# EAGLE design p8x-cf-card (EAGLE 9.6.2)
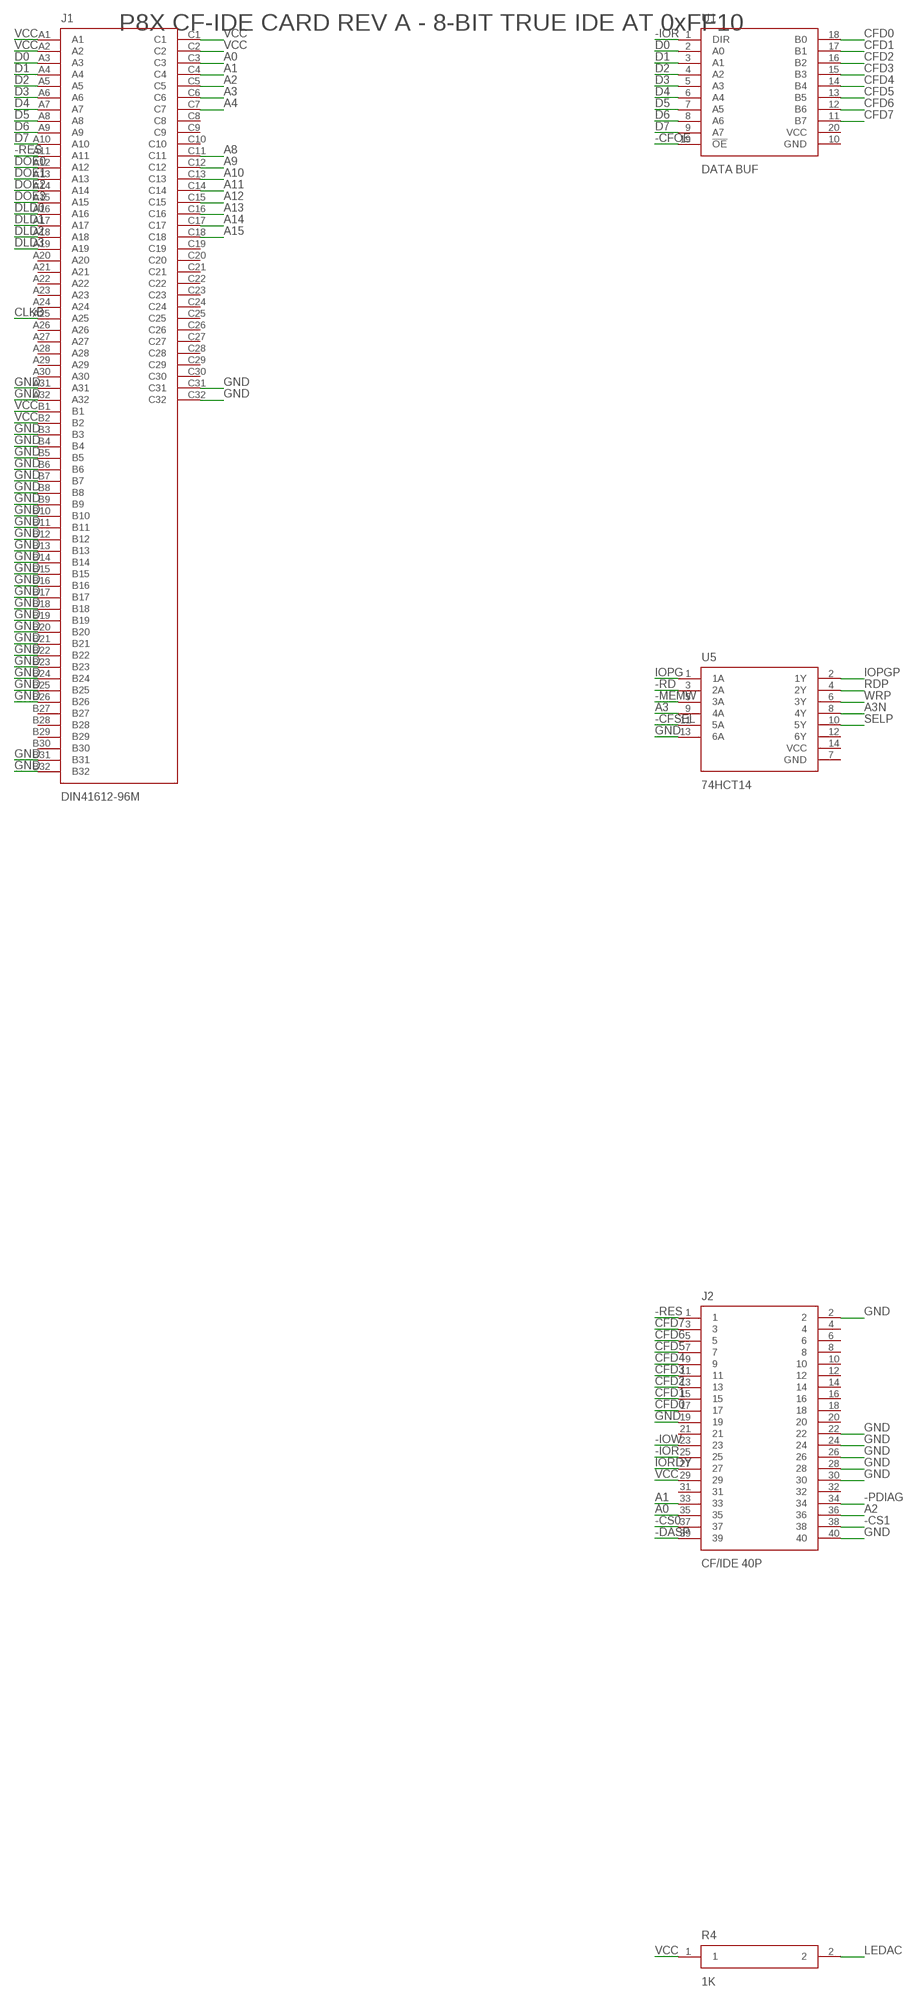
[diagram p0: schematic, sheet 1, part 1 of 2]
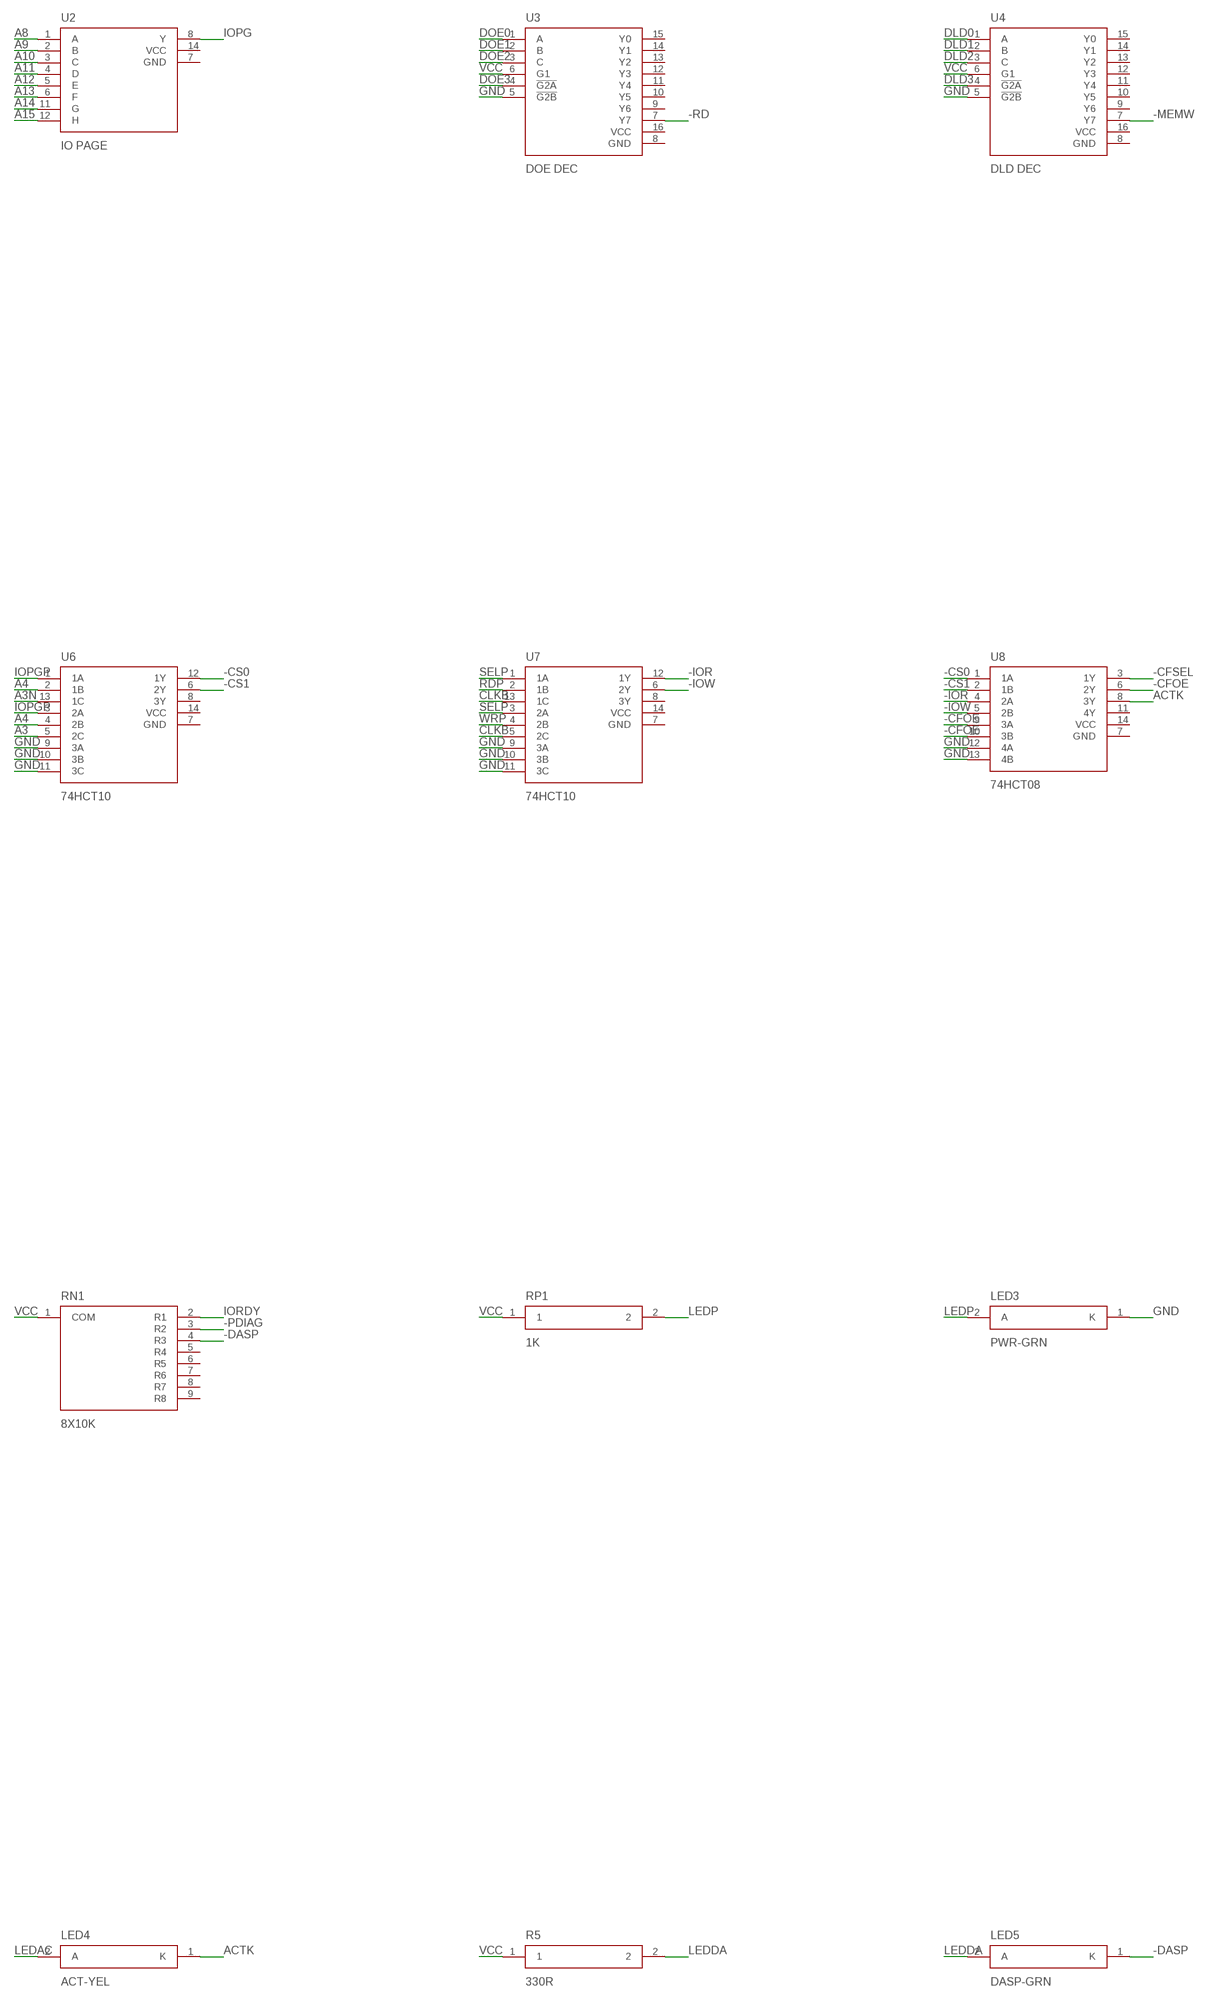
[diagram p1: schematic, sheet 1, part 2 of 2]

## Parts
J1  DIN41612-96M  DIN96  [DIN96]
J2  CF/IDE 40P  IDE40  [HDR40]
LED3  PWR-GRN  LED  [LED5]
LED4  ACT-YEL  LED  [LED5]
LED5  DASP-GRN  LED  [LED5]
R4  1K  RES  [R_AXIAL]
R5  330R  RES  [R_AXIAL]
RN1  8X10K  SIP9  [SIP9]
RP1  1K  RES  [R_AXIAL]
U1  DATA BUF  74245  [DIP20]
U2  IO PAGE  7430  [DIP14]
U3  DOE DEC  74138  [DIP16]
U4  DLD DEC  74138  [DIP16]
U5  74HCT14  HEX14  [DIP14]
U6  74HCT10  7410  [DIP14]
U7  74HCT10  7410  [DIP14]
U8  74HCT08  GATES14  [DIP14]

## Nets
-CFOE: U1.19(!OE) U8.6(2Y) U8.9(3A) U8.10(3B)
-CFSEL: U5.11(5A) U8.3(1Y)
-CS0: J2.37 U6.12(1Y) U8.1(1A)
-CS1: J2.38 U6.6(2Y) U8.2(1B)
-DASP: J2.39 LED5.1(K) RN1.4(R3)
-IOR: J2.25 U1.1(DIR) U7.12(1Y) U8.4(2A)
-IOW: J2.23 U7.6(2Y) U8.5(2B)
-MEMW: U4.7(Y7) U5.5(3A)
-PDIAG: J2.34 RN1.3(R2)
-RD: U3.7(Y7) U5.3(2A)
-RES: J1.A11 J2.1
A0: J1.C3 J2.35
A1: J1.C4 J2.33
A2: J1.C5 J2.36
A3: J1.C6 U5.9(4A) U6.5(2C)
A3N: U5.8(4Y) U6.13(1C)
A4: J1.C7 U6.2(1B) U6.4(2B)
A8: J1.C11 U2.1(A)
A9: J1.C12 U2.2(B)
A10: J1.C13 U2.3(C)
A11: J1.C14 U2.4(D)
A12: J1.C15 U2.5(E)
A13: J1.C16 U2.6(F)
A14: J1.C17 U2.11(G)
A15: J1.C18 U2.12(H)
ACTK: LED4.1(K) U8.8(3Y)
CFD0: J2.17 U1.18(B0)
CFD1: J2.15 U1.17(B1)
CFD2: J2.13 U1.16(B2)
CFD3: J2.11 U1.15(B3)
CFD4: J2.9 U1.14(B4)
CFD5: J2.7 U1.13(B5)
CFD6: J2.5 U1.12(B6)
CFD7: J2.3 U1.11(B7)
CLKB: J1.A25 U7.5(2C) U7.13(1C)
D0: J1.A3 U1.2(A0)
D1: J1.A4 U1.3(A1)
D2: J1.A5 U1.4(A2)
D3: J1.A6 U1.5(A3)
D4: J1.A7 U1.6(A4)
D5: J1.A8 U1.7(A5)
D6: J1.A9 U1.8(A6)
D7: J1.A10 U1.9(A7)
DLD0: J1.A16 U4.1(A)
DLD1: J1.A17 U4.2(B)
DLD2: J1.A18 U4.3(C)
DLD3: J1.A19 U4.4(!G2A)
DOE0: J1.A12 U3.1(A)
DOE1: J1.A13 U3.2(B)
DOE2: J1.A14 U3.3(C)
DOE3: J1.A15 U3.4(!G2A)
GND: J1.A31 J1.A32 J1.B3 J1.B4 J1.B5 J1.B6 J1.B7 J1.B8 J1.B9 J1.B10 J1.B11 J1.B12 J1.B13 J1.B14 J1.B15 J1.B16 J1.B17 J1.B18 J1.B19 J1.B20 J1.B21 J1.B22 J1.B23 J1.B24 J1.B25 J1.B26 J1.B31 J1.B32 J1.C31 J1.C32 J2.2 J2.19 J2.22 J2.24 J2.26 J2.28 J2.30 J2.40 LED3.1(K) U3.5(!G2B) U4.5(!G2B) U5.13(6A) U6.9(3A) U6.10(3B) U6.11(3C) U7.9(3A) U7.10(3B) U7.11(3C) U8.12(4A) U8.13(4B)
IOPG: U2.8(Y) U5.1(1A)
IOPGP: U5.2(1Y) U6.1(1A) U6.3(2A)
IORDY: J2.27 RN1.2(R1)
LEDAC: LED4.2(A) R4.2
LEDDA: LED5.2(A) R5.2
LEDP: LED3.2(A) RP1.2
RDP: U5.4(2Y) U7.2(1B)
SELP: U5.10(5Y) U7.1(1A) U7.3(2A)
VCC: J1.A1 J1.A2 J1.B1 J1.B2 J1.C1 J1.C2 J2.29 R4.1 R5.1 RN1.1(COM) RP1.1 U3.6(G1) U4.6(G1)
WRP: U5.6(3Y) U7.4(2B)
Unconnected: J1.A20 J1.A21 J1.A22 J1.A23 J1.A24 J1.A26 J1.A27 J1.A28 J1.A29 J1.A30 J1.B27 J1.B28 J1.B29 J1.B30 J1.C8 J1.C9 J1.C10 J1.C19 J1.C20 J1.C21 J1.C22 J1.C23 J1.C24 J1.C25 J1.C26 J1.C27 J1.C28 J1.C29 J1.C30 J2.4 J2.6 J2.8 J2.10 J2.12 J2.14 J2.16 J2.18 J2.20 J2.21 J2.31 J2.32 RN1.5(R4) RN1.6(R5) RN1.7(R6) RN1.8(R7) RN1.9(R8) U1.10(GND) U1.20(VCC) U2.7(GND) U2.14(VCC) U3.8(GND) U3.9(Y6) U3.10(Y5) U3.11(Y4) U3.12(Y3) U3.13(Y2) U3.14(Y1) U3.15(Y0) U3.16(VCC) U4.8(GND) U4.9(Y6) U4.10(Y5) U4.11(Y4) U4.12(Y3) U4.13(Y2) U4.14(Y1) U4.15(Y0) U4.16(VCC) U5.7(GND) U5.12(6Y) U5.14(VCC) U6.7(GND) U6.8(3Y) U6.14(VCC) U7.7(GND) U7.8(3Y) U7.14(VCC) U8.7(GND) U8.11(4Y) U8.14(VCC)

## Notes on the sheet
- P8X CF-IDE CARD REV A - 8-BIT TRUE IDE AT 0xFF10

## Library data of the parts
J1 = p8x:DIN96
J2 = p8x:IDE40
LED3-LED5 = p8x:LED
R4 R5 RP1 = p8x:RES
RN1 = p8x:SIP9
U1 = p8x:74245
U2 = p8x:7430
U3 U4 = p8x:74138
U5 = p8x:HEX14
U6 U7 = p8x:7410
U8 = p8x:GATES14

## Board
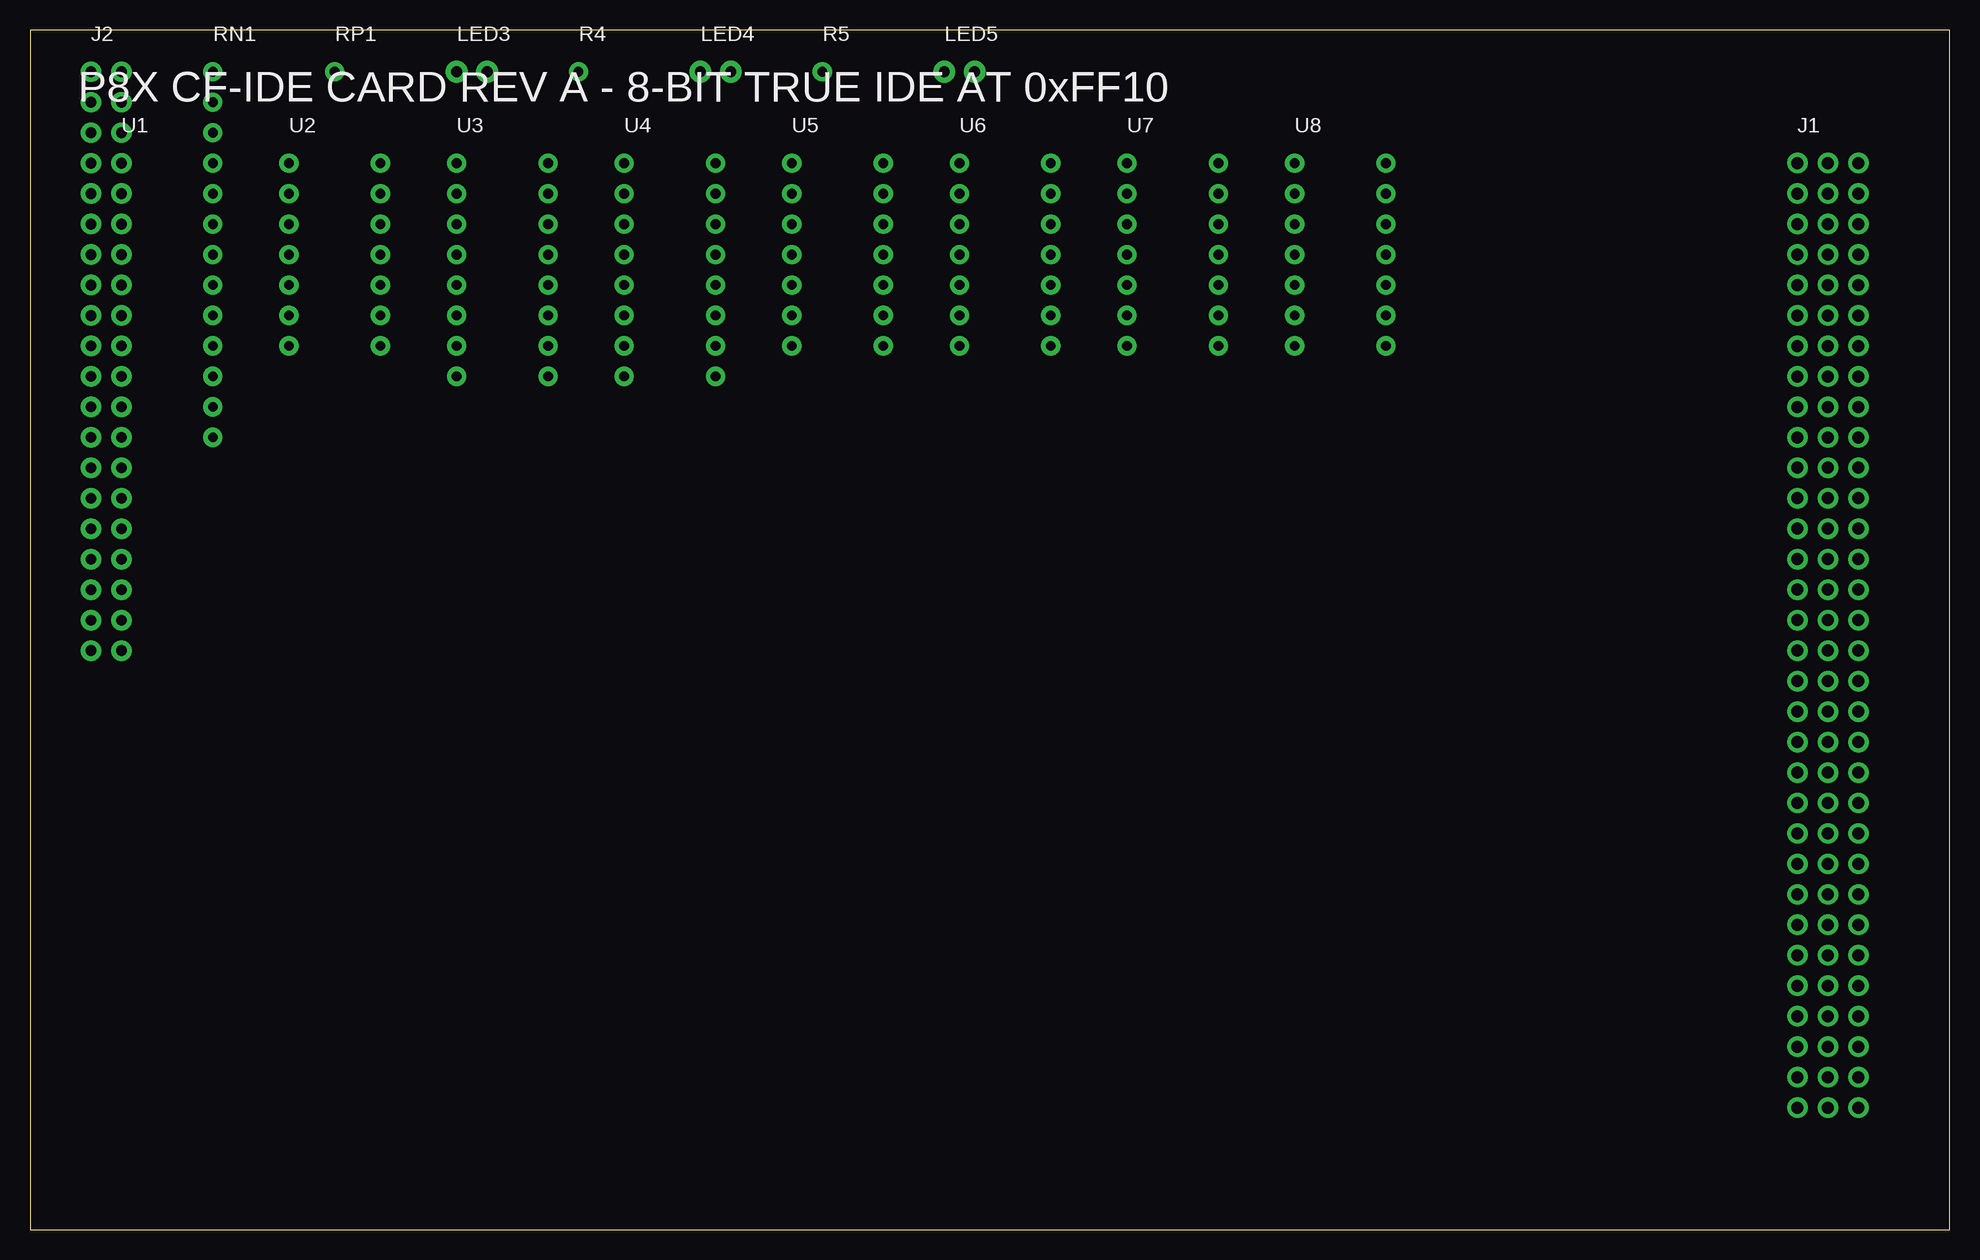
[diagram p2: board, top side]
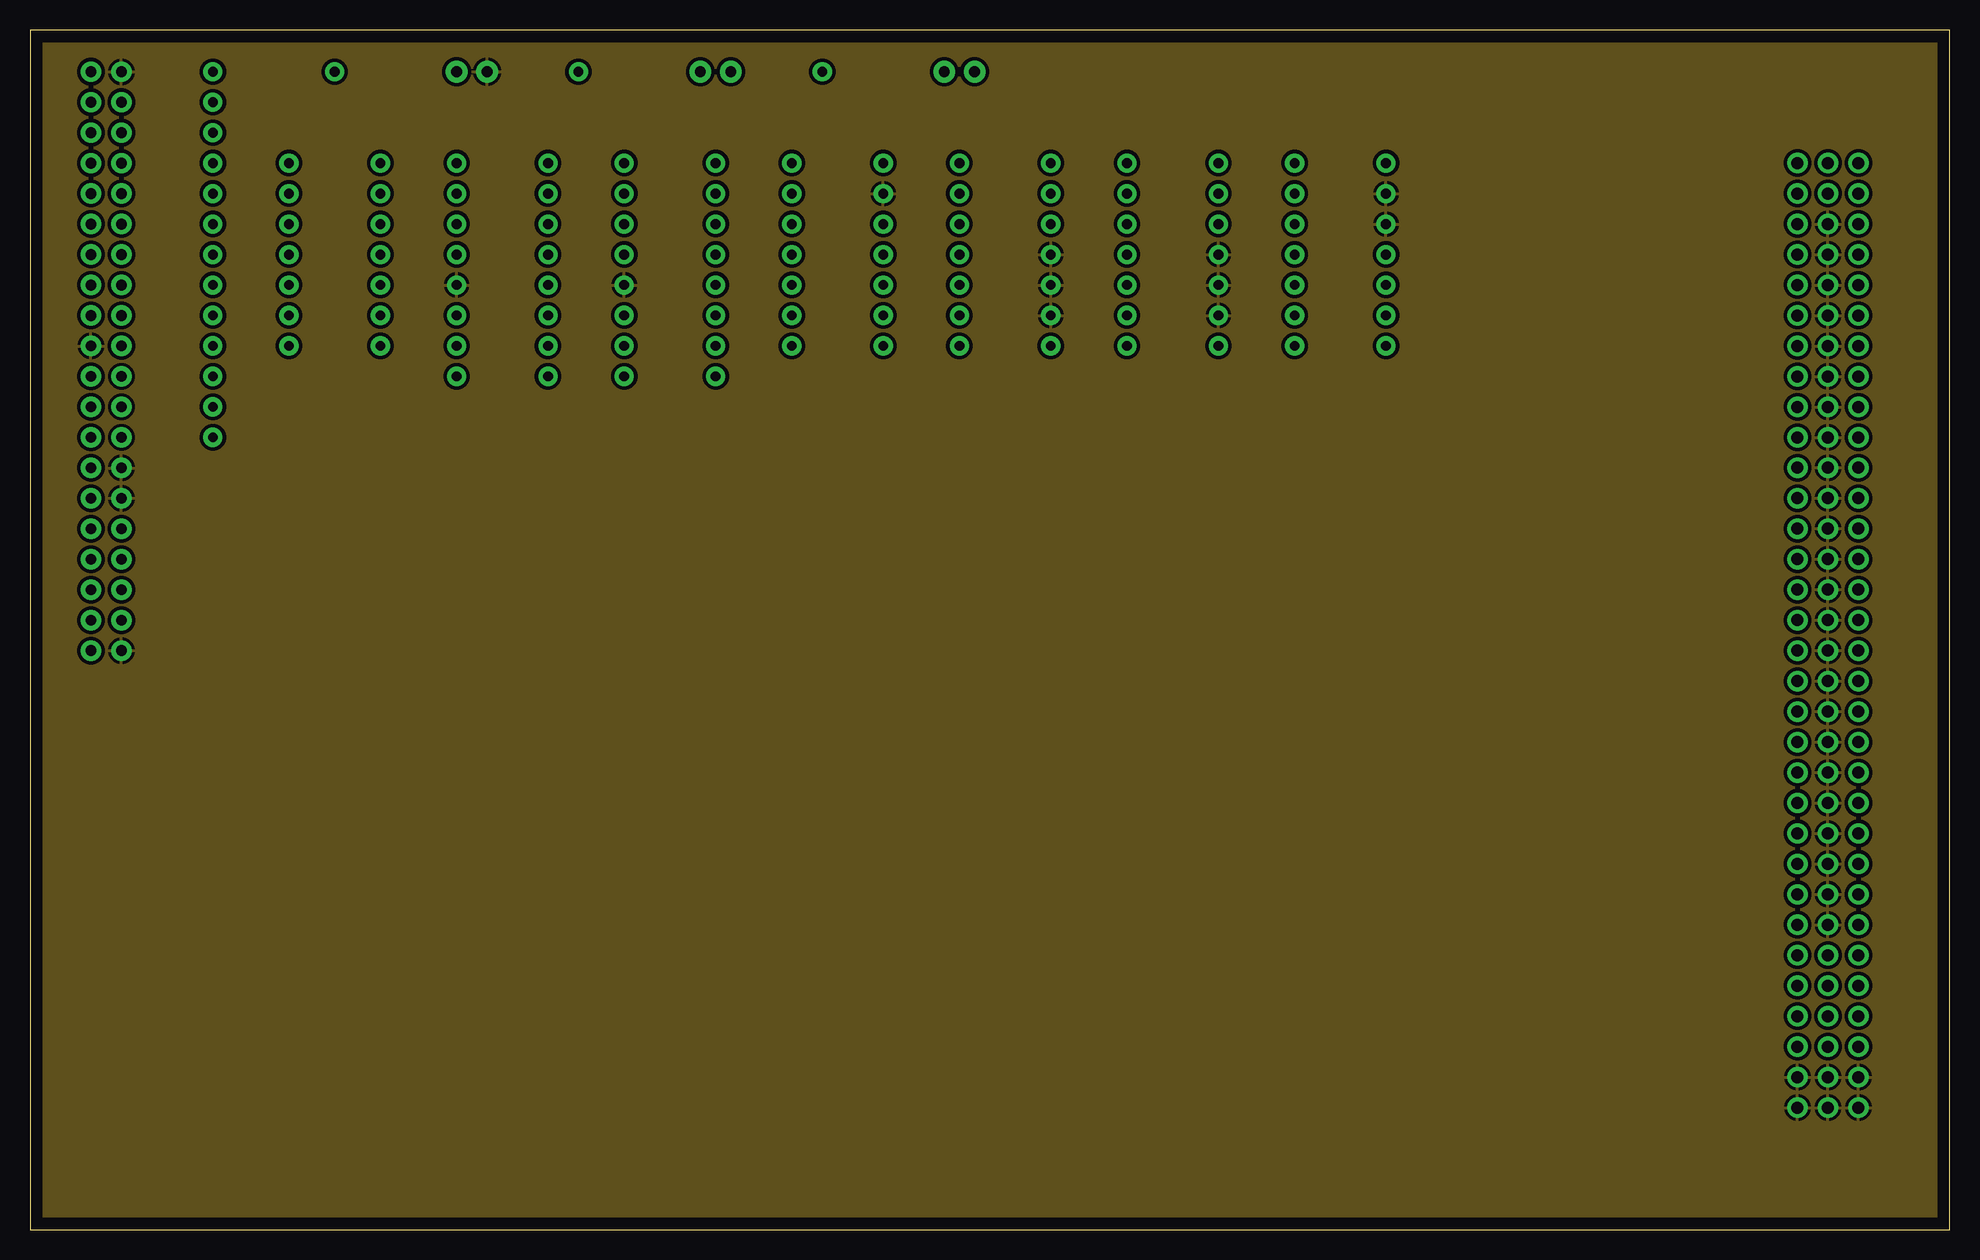
[diagram p3: board, inner layer Route2]
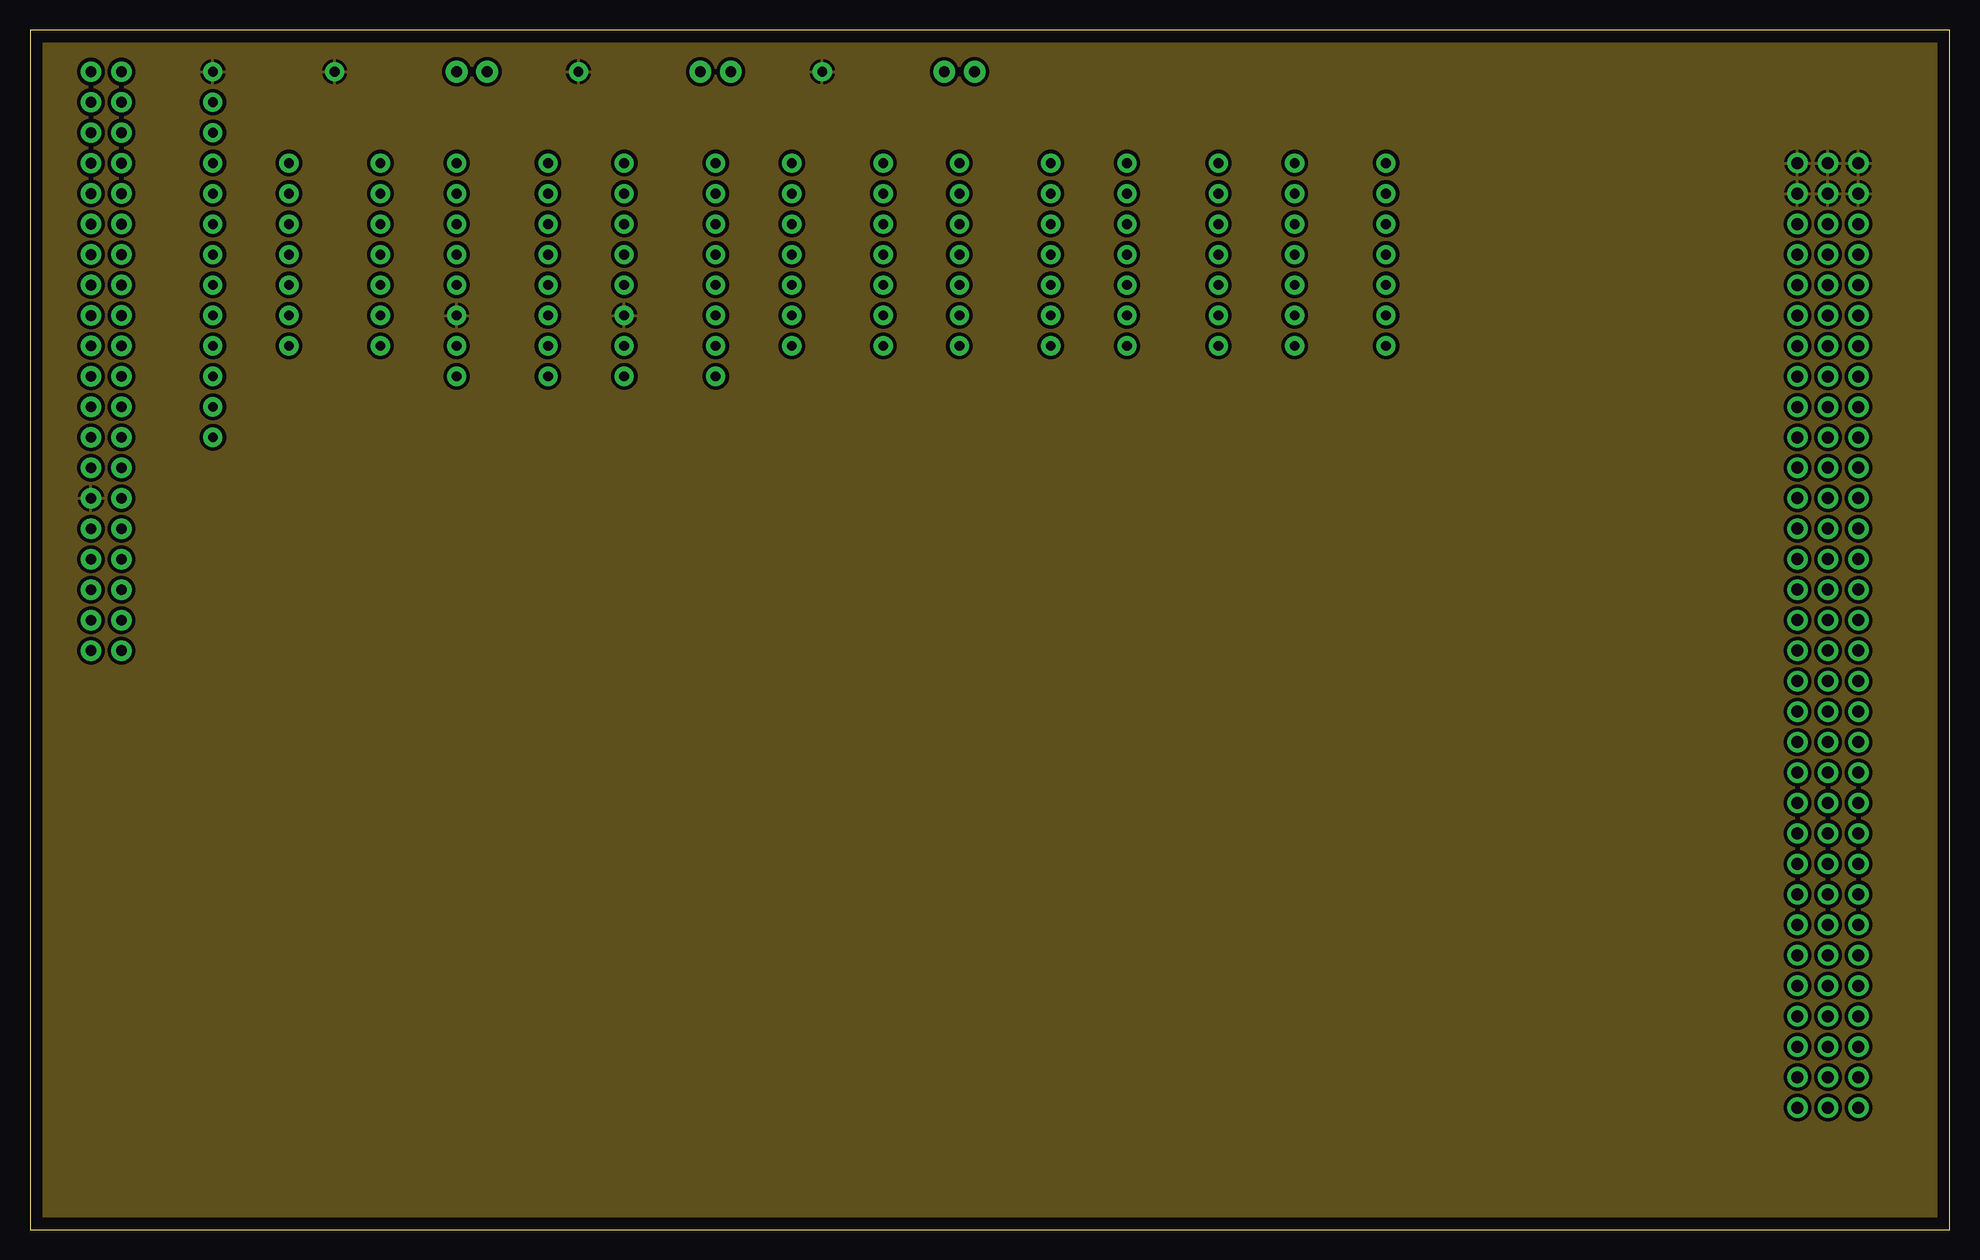
[diagram p4: board, inner layer Route15]

Size 160 x 100 mm. Coordinates in mm from the lower left corner, seen from the top.
Outline: 0,0 160,0 160,100 0,100 0,0
Copper layers (1*2*15*16): Top / Route2 / Route15 / Bottom

### Footprints (pad centres in the part's own frame; a part is rotated, then mirrored left to right if it is on the bottom)
DIN96 = drill 1 pad 1.7: A1 5.08,0; A2 5.08,-2.54; A3 5.08,-5.08; A4 5.08,-7.62; A5 5.08,-10.16; A6 5.08,-12.7; A7 5.08,-15.24; A8 5.08,-17.78; A9 5.08,-20.32; A10 5.08,-22.86; A11 5.08,-25.4; A12 5.08,-27.94; A13 5.08,-30.48; A14 5.08,-33.02; A15 5.08,-35.56; A16 5.08,-38.1; A17 5.08,-40.64; A18 5.08,-43.18; A19 5.08,-45.72; A20 5.08,-48.26; A21 5.08,-50.8; A22 5.08,-53.34; A23 5.08,-55.88; A24 5.08,-58.42; A25 5.08,-60.96; A26 5.08,-63.5; A27 5.08,-66.04; A28 5.08,-68.58; A29 5.08,-71.12; A30 5.08,-73.66; A31 5.08,-76.2; A32 5.08,-78.74; B1 2.54,0; B2 2.54,-2.54; B3 2.54,-5.08; B4 2.54,-7.62; B5 2.54,-10.16; B6 2.54,-12.7; B7 2.54,-15.24; B8 2.54,-17.78; B9 2.54,-20.32; B10 2.54,-22.86; B11 2.54,-25.4; B12 2.54,-27.94; B13 2.54,-30.48; B14 2.54,-33.02; B15 2.54,-35.56; B16 2.54,-38.1; B17 2.54,-40.64; B18 2.54,-43.18; B19 2.54,-45.72; B20 2.54,-48.26; B21 2.54,-50.8; B22 2.54,-53.34; B23 2.54,-55.88; B24 2.54,-58.42; B25 2.54,-60.96; B26 2.54,-63.5; B27 2.54,-66.04; B28 2.54,-68.58; B29 2.54,-71.12; B30 2.54,-73.66; B31 2.54,-76.2; B32 2.54,-78.74; C1 0,0; C2 0,-2.54; C3 0,-5.08; C4 0,-7.62; C5 0,-10.16; C6 0,-12.7; C7 0,-15.24; C8 0,-17.78; C9 0,-20.32; C10 0,-22.86; C11 0,-25.4; C12 0,-27.94; C13 0,-30.48; C14 0,-33.02; C15 0,-35.56; C16 0,-38.1; C17 0,-40.64; C18 0,-43.18; C19 0,-45.72; C20 0,-48.26; C21 0,-50.8; C22 0,-53.34; C23 0,-55.88; C24 0,-58.42; C25 0,-60.96; C26 0,-63.5; C27 0,-66.04; C28 0,-68.58; C29 0,-71.12; C30 0,-73.66; C31 0,-76.2; C32 0,-78.74
HDR40 = drill 0.9 pad 1.7: 1 0,0; 2 2.54,0; 3 0,-2.54; 4 2.54,-2.54; 5 0,-5.08; 6 2.54,-5.08; 7 0,-7.62; 8 2.54,-7.62; 9 0,-10.16; 10 2.54,-10.16; 11 0,-12.7; 12 2.54,-12.7; 13 0,-15.24; 14 2.54,-15.24; 15 0,-17.78; 16 2.54,-17.78; 17 0,-20.32; 18 2.54,-20.32; 19 0,-22.86; 20 2.54,-22.86; 21 0,-25.4; 22 2.54,-25.4; 23 0,-27.94; 24 2.54,-27.94; 25 0,-30.48; 26 2.54,-30.48; 27 0,-33.02; 28 2.54,-33.02; 29 0,-35.56; 30 2.54,-35.56; 31 0,-38.1; 32 2.54,-38.1; 33 0,-40.64; 34 2.54,-40.64; 35 0,-43.18; 36 2.54,-43.18; 37 0,-45.72; 38 2.54,-45.72; 39 0,-48.26; 40 2.54,-48.26
LED5 = drill 0.9 pad 1.8: 1 2.54,0; 2 0,0
R_AXIAL = drill 0.8 pad 1.6: 1 0,0; 2 10.16,0
SIP9 = drill 0.8 pad 1.6: 1 0,0; 2 0,-2.54; 3 0,-5.08; 4 0,-7.62; 5 0,-10.16; 6 0,-12.7; 7 0,-15.24; 8 0,-17.78; 9 0,-20.32
DIP20 = drill 0.813 pad 1.6: 1 0,0; 2 0,-2.54; 3 0,-5.08; 4 0,-7.62; 5 0,-10.16; 6 0,-12.7; 7 0,-15.24; 8 0,-17.78; 9 0,-20.32; 10 0,-22.86; 11 7.62,-22.86; 12 7.62,-20.32; 13 7.62,-17.78; 14 7.62,-15.24; 15 7.62,-12.7; 16 7.62,-10.16; 17 7.62,-7.62; 18 7.62,-5.08; 19 7.62,-2.54; 20 7.62,0
DIP14 = drill 0.813 pad 1.6: 1 0,0; 2 0,-2.54; 3 0,-5.08; 4 0,-7.62; 5 0,-10.16; 6 0,-12.7; 7 0,-15.24; 8 7.62,-15.24; 9 7.62,-12.7; 10 7.62,-10.16; 11 7.62,-7.62; 12 7.62,-5.08; 13 7.62,-2.54; 14 7.62,0
DIP16 = drill 0.813 pad 1.6: 1 0,0; 2 0,-2.54; 3 0,-5.08; 4 0,-7.62; 5 0,-10.16; 6 0,-12.7; 7 0,-15.24; 8 0,-17.78; 9 7.62,-17.78; 10 7.62,-15.24; 11 7.62,-12.7; 12 7.62,-10.16; 13 7.62,-7.62; 14 7.62,-5.08; 15 7.62,-2.54; 16 7.62,0

### Placement (x,y rotation side)
J1  147.32,88.9 0 top
J2  5.08,96.52 0 top
LED3  35.56,96.52 0 top
LED4  55.88,96.52 0 top
LED5  76.2,96.52 0 top
R4  45.72,96.52 0 top
R5  66.04,96.52 0 top
RN1  15.24,96.52 0 top
RP1  25.4,96.52 0 top
U1  7.62,88.9 0 top
U2  21.59,88.9 0 top
U3  35.56,88.9 0 top
U4  49.53,88.9 0 top
U5  63.5,88.9 0 top
U6  77.47,88.9 0 top
U7  91.44,88.9 0 top
U8  105.41,88.9 0 top

### Tracks (layer width: path | path; a pad name or v marks a point on that pad's centre or on a via)
GND
  pour Route2 (isolate 0.3): 0,0 160,0 160,100 0,100
VCC
  pour Route15 (isolate 0.3): 0,0 160,0 160,100 0,100

### Text on the board
tPlace: P8X CF-IDE CARD REV A - 8-BIT TRUE IDE AT 0xFF10